# Altium schematic sheet LoraEp.SchDoc
size A3
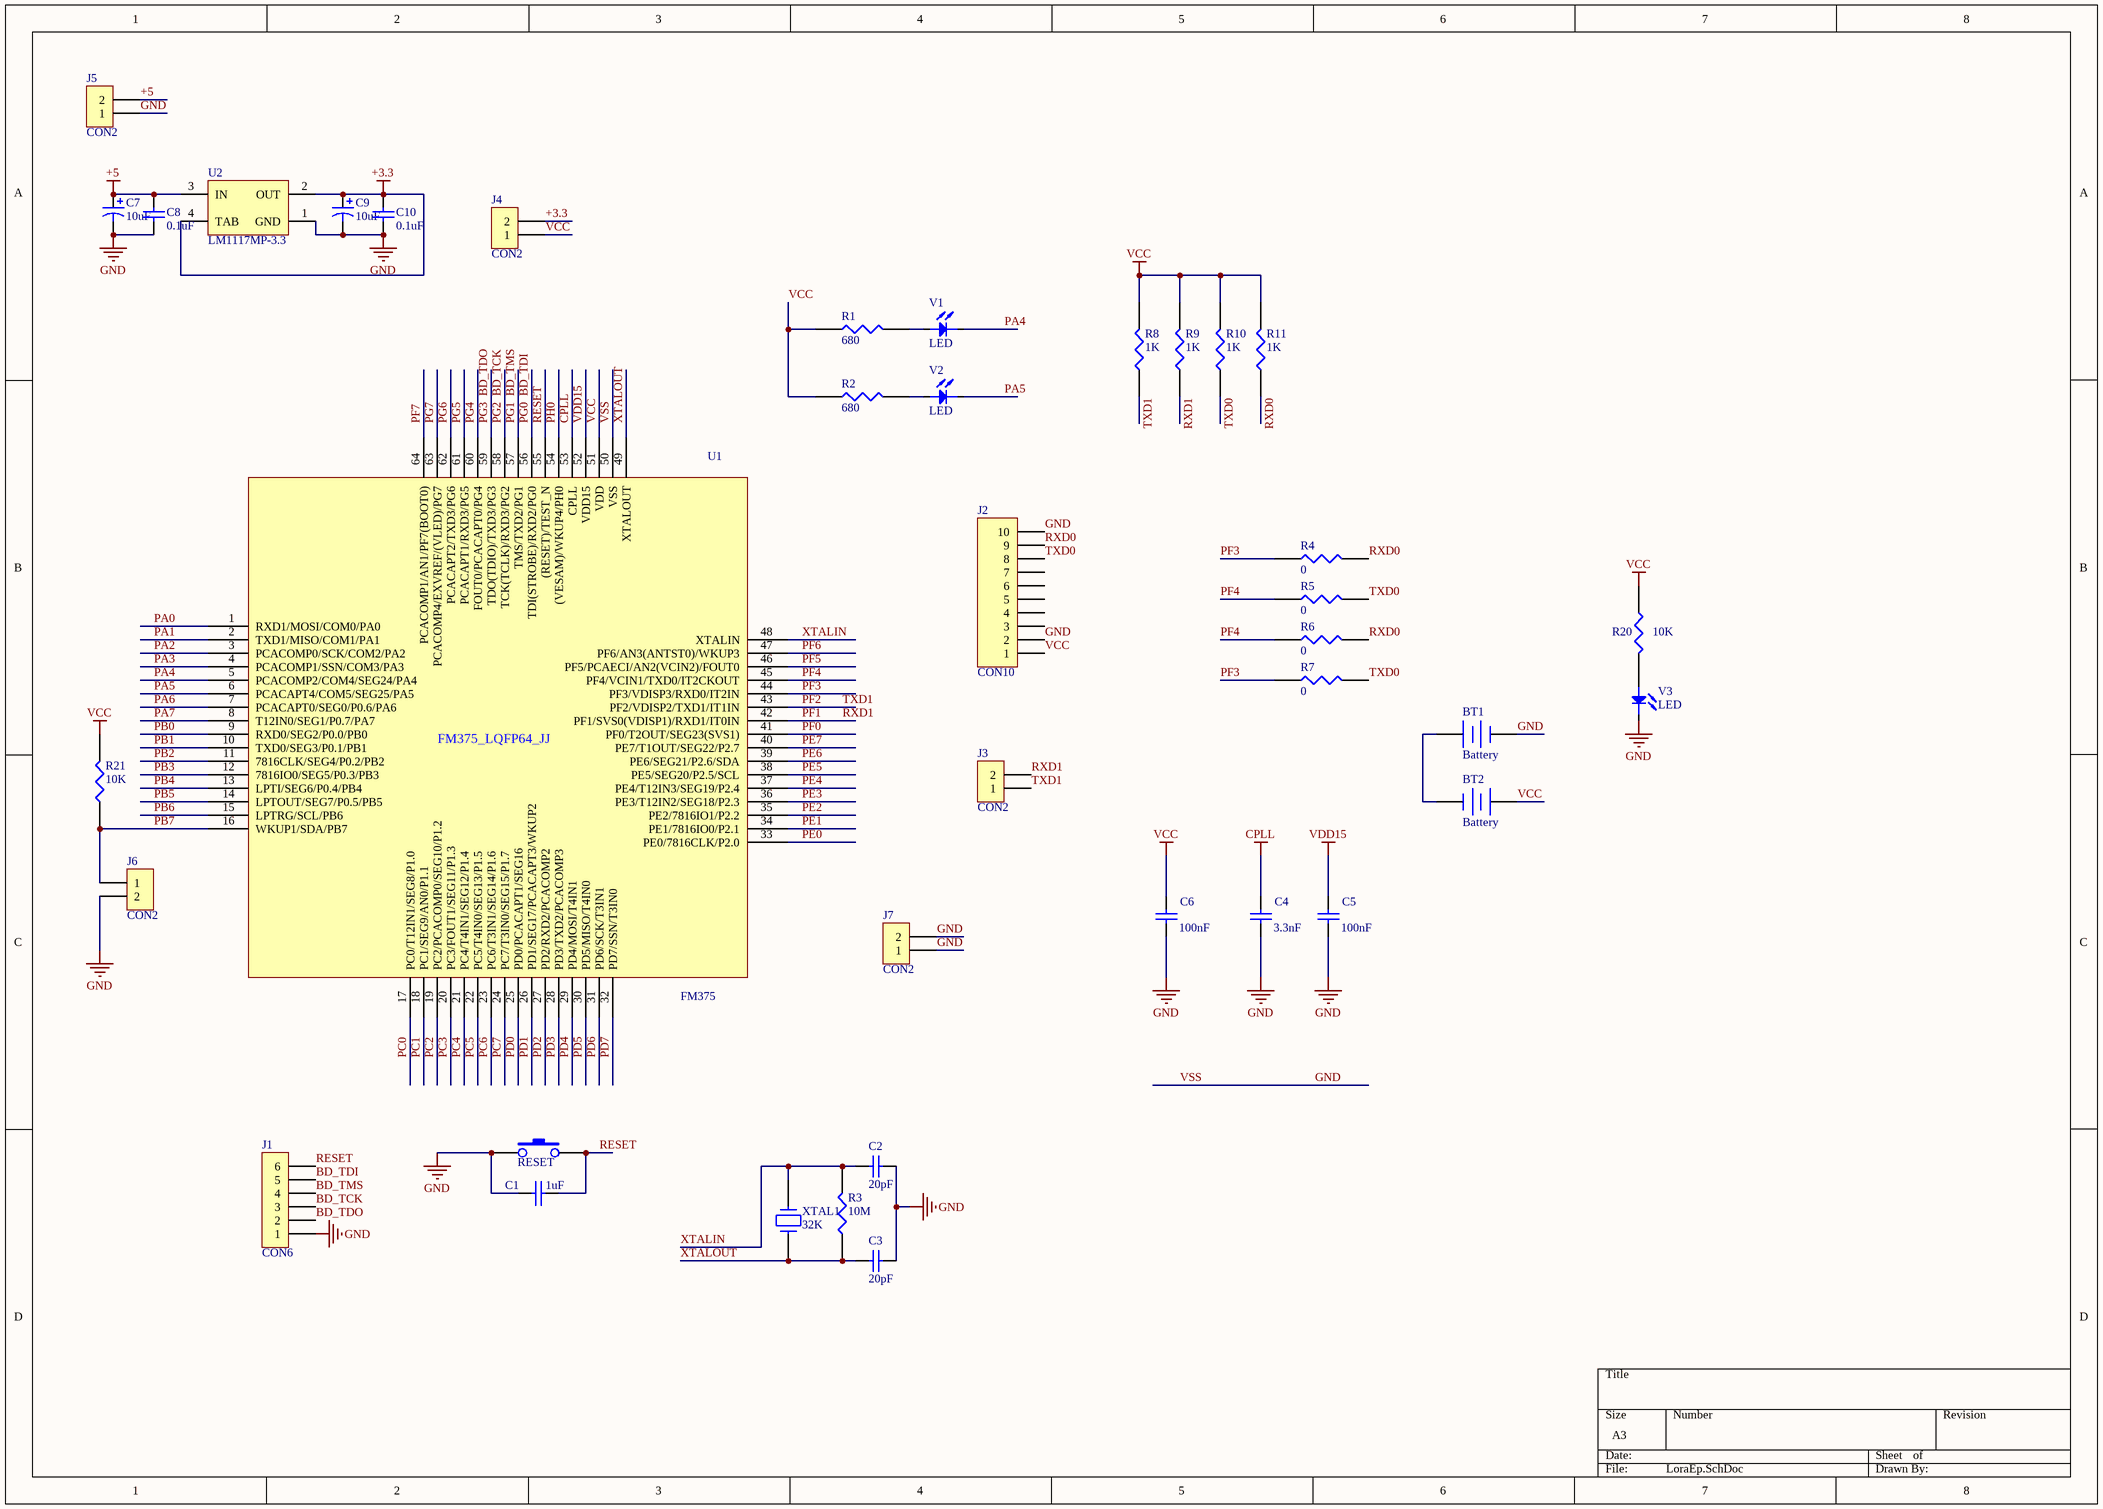
[diagram p0: LoraEp.SchDoc]

## Parts
BT1  Battery  [BAT]
BT2  Battery  [BAT]
C1  1uF  [0805]
C2  20pF  [0805]
C3  20pF  [0805]
C4  3.3nF  [0805]
C5  100nF  [0805]
C6  100nF  [0805]
C7  10uF  [0805]
C8  0.1uF  [0805]
C9  10uF  [0805]
C10  0.1uF  [0805]
J1  CON6  [SIP6]
J2  CON10  [SSIP10]
J3  CON2  [SIP2]
J4  CON2  [SIP2]
J5  CON2  [SourPad]
J6  CON2  [SIP2]
J7  CON2  [HDR1X2]
R1  680  [0805]
R2  680  [0805]
R3  10M  [0805]
R4  0  [0805]
R5  0  [0805]
R6  0  [0805]
R7  0  [0805]
R8  1K  [0805]
R9  1K  [0805]
R10  1K  [0805]
R11  1K  [0805]
R20  10K  [0805]
R21  10K  [0805]
RESET  KEY  [BUTTON-S]  (value not drawn)
U1  FM375  [LQFP64-0.5]
U2  LM1117MP-3.3  [MP04A_L]
V1  LED  [SIP2]
V2  LED  [SIP2]
V3  LED  [0805]
XTAL1  32K  [XTAL-RB32K_2]

## Nets
+3.3: C9.1 C10.2 J4.2 U2.2(OUT) U2.4(TAB)
+5: C7.1 C8.2 J5.2 U2.3(IN)
CPLL: C4.2 U1.53(CPLL)
GND: BT1.2(-) C1.2 C2.2 C3.2 C4.1 C5.1 C6.1 C7.2 C8.1 C9.2 C10.1 J1.1 J2.2 J2.10 J5.1 J6.2 J7.1 J7.2 RESET.1 U1.50(VSS) U2.1(GND) V3.2  [also labelled VSS]
VCC: BT2.1(+) C6.2 J2.1 J4.1 R1.1 R2.1 R8.2 R9.2 R10.2 R11.2 R20.1 R21.2 U1.51(VDD)
VDD15: C5.2 U1.52(VDD15)
BD_TCK: J1.3 U1.58(TCK(TCLK)/RXD3/PG2)  [also labelled PG2]
BD_TDI: J1.5 U1.56(TDI(STROBE)/RXD2/PG0)  [also labelled PG0]
BD_TDO: J1.2 U1.59(TDO(TDIO)/TXD3/PG3)  [also labelled PG3]
BD_TMS: J1.4 U1.57(TMS/TXD2/PG1)  [also labelled PG1]
PA0: U1.1(RXD1/MOSI/COM0/PA0)
PA1: U1.2(TXD1/MISO/COM1/PA1)
PA2: U1.3(PCACOMP0/SCK/COM2/PA2)
PA3: U1.4(PCACOMP1/SSN/COM3/PA3)
PA4: U1.5(PCACOMP2/COM4/SEG24/PA4) V1.2
PA5: U1.6(PCACAPT4/COM5/SEG25/PA5) V2.2
PA6: U1.7(PCACAPT0/SEG0/P0.6/PA6)
PA7: U1.8(T12IN0/SEG1/P0.7/PA7)
PB0: U1.9(RXD0/SEG2/P0.0/PB0)
PB1: U1.10(TXD0/SEG3/P0.1/PB1)
PB2: U1.11(7816CLK/SEG4/P0.2/PB2)
PB3: U1.12(7816IO0/SEG5/P0.3/PB3)
PB4: U1.13(LPTI/SEG6/P0.4/PB4)
PB5: U1.14(LPTOUT/SEG7/P0.5/PB5)
PB6: U1.15(LPTRG/SCL/PB6)
PB7: J6.1 R21.1 U1.16(WKUP1/SDA/PB7)
PC0: U1.17(PC0/T12IN1/SEG8/P1.0)
PC1: U1.18(PC1/SEG9/AN0/P1.1)
PC2: U1.19(PC2/PCACOMP0/SEG10/P1.2)
PC3: U1.20(PC3/FOUT1/SEG11/P1.3)
PC4: U1.21(PC4/T4IN1/SEG12/P1.4)
PC5: U1.22(PC5/T4IN0/SEG13/P1.5)
PC6: U1.23(PC6/T3IN1/SEG14/P1.6)
PC7: U1.24(PC7/T3IN0/SEG15/P1.7)
PD0: U1.25(PD0/PCACAPT1/SEG16)
PD1: U1.26(PD1/SEG17/PCACAPT3/WKUP2)
PD2: U1.27(PD2/RXD2/PCACOMP2)
PD3: U1.28(PD3/TXD2/PCACOMP3)
PD4: U1.29(PD4/MOSI/T4IN1)
PD5: U1.30(PD5/MISO/T4IN0)
PD6: U1.31(PD6/SCK/T3IN1)
PD7: U1.32(PD7/SSN/T3IN0)
PE0: U1.33(PE0/7816CLK/P2.0)
PE1: U1.34(PE1/7816IO0/P2.1)
PE2: U1.35(PE2/7816IO1/P2.2)
PE3: U1.36(PE3/T12IN2/SEG18/P2.3)
PE4: U1.37(PE4/T12IN3/SEG19/P2.4)
PE5: U1.38(PE5/SEG20/P2.5/SCL)
PE6: U1.39(PE6/SEG21/P2.6/SDA)
PE7: U1.40(PE7/T1OUT/SEG22/P2.7)
PF0: U1.41(PF0/T2OUT/SEG23(SVS1))
PF1: J3.2 R9.1 U1.42(PF1/SVS0(VDISP1)/RXD1/IT0IN)  [also labelled RXD1]
PF2: J3.1 R8.1 U1.43(PF2/VDISP2/TXD1/IT1IN)  [also labelled TXD1]
PF3: R4.1 R7.1 U1.44(PF3/VDISP3/RXD0/IT2IN)
PF4: R5.1 R6.1 U1.45(PF4/VCIN1/TXD0/IT2CKOUT)
PF5: U1.46(PF5/PCAECI/AN2(VCIN2)/FOUT0)
PF6: U1.47(PF6/AN3(ANTST0)/WKUP3)
PF7: U1.64(PCACOMP1/AN1/PF7(BOOT0))
PG4: U1.60(FOUT0/PCACAPT0/PG4)
PG5: U1.61(PCACAPT1/RXD3/PG5)
PG6: U1.62(PCACAPT2/TXD3/PG6)
PG7: U1.63(PCACOMP4/EXVREF/(VLED)/PG7)
PH0: U1.54((VESAM)/WKUP4/PH0)
RESET: C1.1 J1.6 RESET.2 U1.55((RESET)/TEST_N)
RXD0: J2.9 R4.2 R6.2 R11.1
TXD0: J2.8 R5.2 R7.2 R10.1
XTALIN: C2.1 R3.2 U1.48(XTALIN) XTAL1.2
XTALOUT: C3.1 R3.1 U1.49(XTALOUT) XTAL1.1
NetBT1_1: BT1.1(+) BT2.2(-)
NetR1_2: R1.2 V1.1
NetR2_2: R2.2 V2.1
NetR20_2: R20.2 V3.1

Not connected (* = marked no-connect by the designer): J2 3 4 5 6 7

## Notes on the sheet
- (in symbol LQFP64-JJ) FM375_LQFP64_JJ

## Library data of the parts
BT1 BT2 = Battery: Multicell Battery; Published: 24-Mar-1999; LatestRevisionDate: 17-Jul-2002; LatestRevisionNote: Re-released for DXP Platform.; PackageReference: BAT-2; Publisher: Altium Limited; PackageDescription: Battery; 2 Leads
C1 = CAP: 一般瓷片电容、直插选用RAD0.1，贴片选用0805
C2 C3 C6 C8 C10 = Cap: Capacitor; Published: 8-Jun-2000; LatestRevisionDate: 17-Jul-2002; LatestRevisionNote: Re-released for DXP Platform.; Publisher: Altium Limited
  C2 C3: PackageReference: RAD-0.3; Value: 20pF
  C6: PackageReference: RAD-0.3; Value: 100nF
  C8 C10: PackageReference: 0805; Value: 0.1uF
C4 = Cap: Capacitor; Value: 100nF; Published: 8-Jun-2000; LatestRevisionDate: 17-Jul-2002; LatestRevisionNote: Re-released for DXP Platform.; PackageReference: RAD-0.3; Publisher: Altium Limited
C5 = Cap: Capacitor; Value: 1nF; Published: 8-Jun-2000; LatestRevisionDate: 17-Jul-2002; LatestRevisionNote: Re-released for DXP Platform.; PackageReference: RAD-0.3; Publisher: Altium Limited
C7 C9 = Cap Pol1: Polarized Capacitor (Radial); Published: 8-Jun-2000; LatestRevisionDate: 17-Jul-2002; LatestRevisionNote: Re-released for DXP Platform.; PackageReference: 0805; Publisher: Altium Limited; Value: 10uF
J1 = CON6: Connector
J2 = CON10: Connector
J3-J7 = CON2: Connector
R1 R2 R4-R11 R20 R21 = RES1: 电阻，1/4w的金属膜直插可选AXIAL0.4封装（长度10mm），贴片可选0805封装，其他电阻可选AXIAL0.5～AXIAL1.0
R3 = RES1
RESET = SW-PB: 乒乓球按键（压下后接通，松开自动断开），较大按键尺寸12mmX12mm选用BUTTON-L封装，较小尺寸6mmX6mm选用BUTTON-S封装
U1 = LQFP64-JJ
U2 = LM1117MP-3.3: 800mA Low-Dropout Linear Regulator; Manufacturer: National Semiconductor; CompType: LDO IC; PackageTopMarking: XYTT*N05A; Published: 27-Nov-2008; DatasheetVersion: Apr-2006; PackageVersion: revB, Apr-2003; PackageReference: MP04A; Publisher: Altium Limited; PackageDescription: Molded SOT-223, 6.50 x 3.56 x 1.6mm Body, 4 Lead, 2.3mm Pitch; PartNumber: LM1117MP-3.3; RoHS: O; PinCount: 4; DigiKeyPartNumber: LM1117MP-3.3CT-ND; Code_JEDEC: TO-261-AA; Code_IPC: SOT223-4; ComponentLink1Description: LM1117 Datasheet; ComponentLink1URL: http://www.national.com/ds/LM/LM1117.pdf; ComponentLink2Description: LM1117 Web Page; ComponentLink2URL: http://www.national.com/pf/LM/LM1117.html; ComponentLink3Description: MP04A Package Page; ComponentLink3URL: http://www.national.com/packaging/folders/mp04a.html
XTAL1 = CRYSTAL